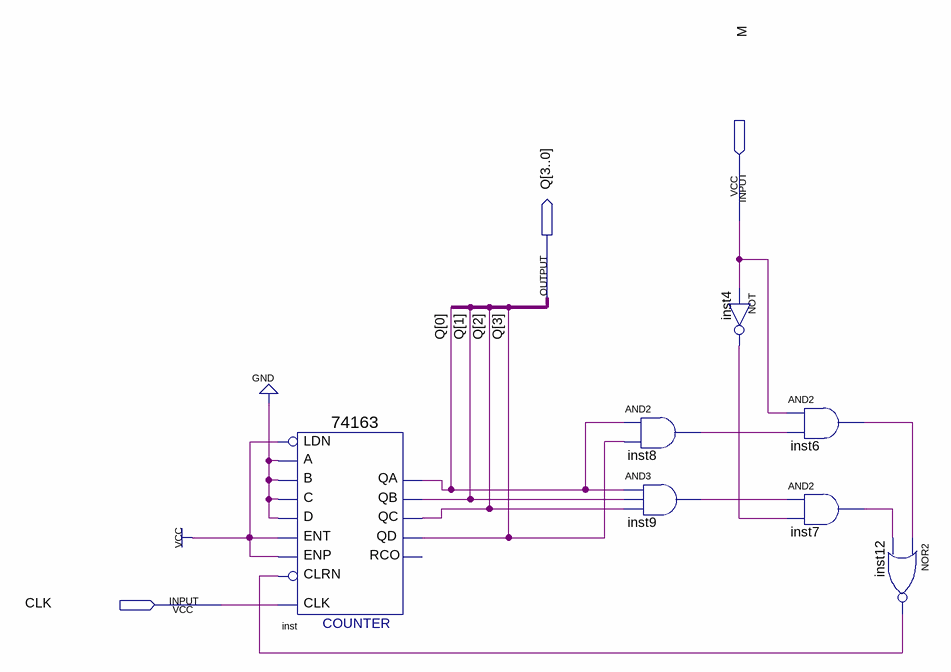
[diagram p0: schematic sheet]
// Quartus schematic MSpecialCount.bdf as structural Verilog: 7 symbols, 3 pins
module MSpecialCount (
  input  M,
  input  CLK,
  output [3:0] Q
);

  wire inst4_out, inst6_out, inst7_out, inst8_out, inst9_out, inst12_out;

  \74163  inst (
    .C(1'b0), .B(1'b0), .A(1'b0), .ENT(1'b1), .D(1'b0), .CLRN(inst12_out), .CLK(CLK), .ENP(1'b1), .LDN(1'b1),
    .QA(Q[0]), .QB(Q[1]), .QC(Q[2]), .QD(Q[3]));  // open: RCO
  and inst8 (inst8_out, Q[0], Q[3]);
  and inst9 (inst9_out, Q[0], Q[1], Q[2]);
  not inst4 (inst4_out, M);
  and inst6 (inst6_out, M, inst8_out);
  and inst7 (inst7_out, inst9_out, inst4_out);
  nor inst12 (inst12_out, inst6_out, inst7_out);
endmodule
